# Altium schematic sheet Eth_Switch_RJ45.SchDoc
size A3
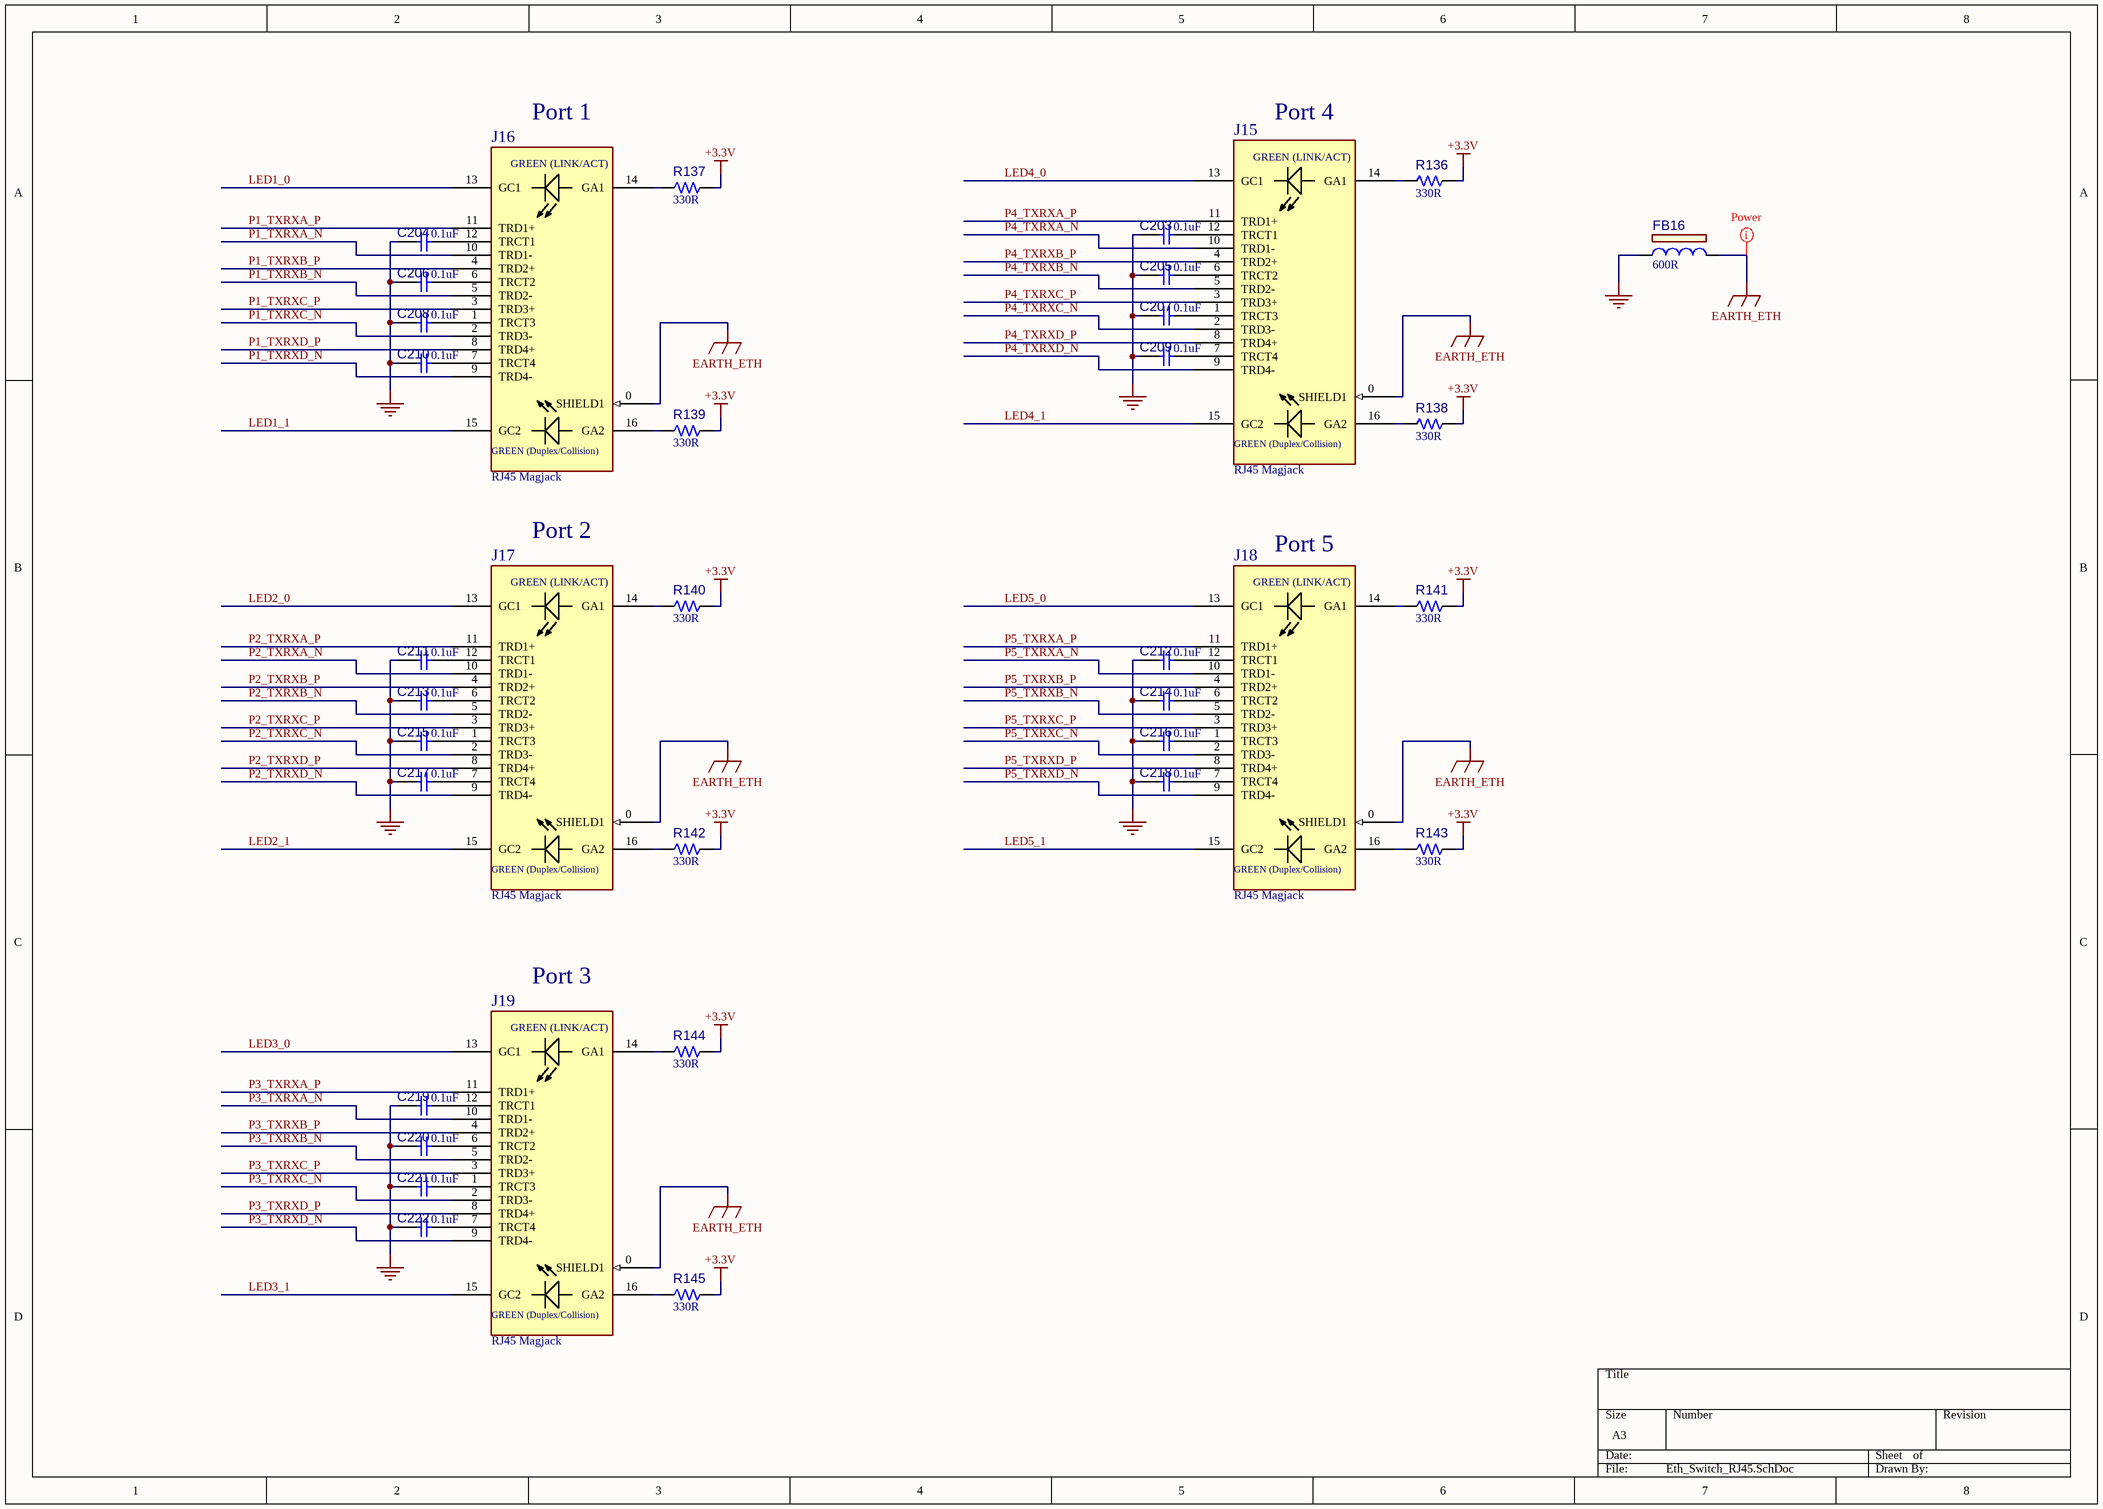
[diagram p0: Eth_Switch_RJ45.SchDoc]

## Parts
C203  value 0.1uF  [CAP_C_0402]  (hidden comment: Capacitor NP)
C204  value 0.1uF  [CAP_C_0402]  (hidden comment: Capacitor NP)
C205  value 0.1uF  [CAP_C_0402]  (hidden comment: Capacitor NP)
C206  value 0.1uF  [CAP_C_0402]  (hidden comment: Capacitor NP)
C207  value 0.1uF  [CAP_C_0402]  (hidden comment: Capacitor NP)
C208  value 0.1uF  [CAP_C_0402]  (hidden comment: Capacitor NP)
C209  value 0.1uF  [CAP_C_0402]  (hidden comment: Capacitor NP)
C210  value 0.1uF  [CAP_C_0402]  (hidden comment: Capacitor NP)
C211  value 0.1uF  [CAP_C_0402]  (hidden comment: Capacitor NP)
C212  value 0.1uF  [CAP_C_0402]  (hidden comment: Capacitor NP)
C213  value 0.1uF  [CAP_C_0402]  (hidden comment: Capacitor NP)
C214  value 0.1uF  [CAP_C_0402]  (hidden comment: Capacitor NP)
C215  value 0.1uF  [CAP_C_0402]  (hidden comment: Capacitor NP)
C216  value 0.1uF  [CAP_C_0402]  (hidden comment: Capacitor NP)
C217  value 0.1uF  [CAP_C_0402]  (hidden comment: Capacitor NP)
C218  value 0.1uF  [CAP_C_0402]  (hidden comment: Capacitor NP)
C219  value 0.1uF  [CAP_C_0402]  (hidden comment: Capacitor NP)
C220  value 0.1uF  [CAP_C_0402]  (hidden comment: Capacitor NP)
C221  value 0.1uF  [CAP_C_0402]  (hidden comment: Capacitor NP)
C222  value 0.1uF  [CAP_C_0402]  (hidden comment: Capacitor NP)
FB16  value 600R  [IND_C_0805]  (hidden comment: Ferrite Bead)
J15  RJ45 Magjack  [CON_MODULAR_RJ45_TH_RA_RJMG2012211A0FR]
J16  RJ45 Magjack  [CON_MODULAR_RJ45_TH_RA_RJMG2012211A0FR]
J17  RJ45 Magjack  [CON_MODULAR_RJ45_TH_RA_RJMG2012211A0FR]
J18  RJ45 Magjack  [CON_MODULAR_RJ45_TH_RA_RJMG2012211A0FR]
J19  RJ45 Magjack  [CON_MODULAR_RJ45_TH_RA_RJMG2012211A0FR]
R136  value 330R  [RES_C_0603]  (hidden comment: Resistor)
R137  value 330R  [RES_C_0603]  (hidden comment: Resistor)
R138  value 330R  [RES_C_0603]  (hidden comment: Resistor)
R139  value 330R  [RES_C_0603]  (hidden comment: Resistor)
R140  value 330R  [RES_C_0603]  (hidden comment: Resistor)
R141  value 330R  [RES_C_0603]  (hidden comment: Resistor)
R142  value 330R  [RES_C_0603]  (hidden comment: Resistor)
R143  value 330R  [RES_C_0603]  (hidden comment: Resistor)
R144  value 330R  [RES_C_0603]  (hidden comment: Resistor)
R145  value 330R  [RES_C_0603]  (hidden comment: Resistor)

## Nets
+3.3V: R136.2 R137.2 R138.2 R139.2 R140.2 R141.2 R142.2 R143.2 R144.2 R145.2
EARTH_ETH: FB16.2 J15.0(SHIELD1) J16.0(SHIELD1) J17.0(SHIELD1) J18.0(SHIELD1) J19.0(SHIELD1)
GND: C203.2 C204.2 C205.2 C206.2 C207.2 C208.2 C209.2 C210.2 C211.2 C212.2 C213.2 C214.2 C215.2 C216.2 C217.2 C218.2 C219.2 C220.2 C221.2 C222.2 FB16.1
LED1_0: J16.13(GC1)
LED1_1: J16.15(GC2)
LED2_0: J17.13(GC1)
LED2_1: J17.15(GC2)
LED3_0: J19.13(GC1)
LED3_1: J19.15(GC2)
LED4_0: J15.13(GC1)
LED4_1: J15.15(GC2)
LED5_0: J18.13(GC1)
LED5_1: J18.15(GC2)
P1_TXRXA_N: J16.10(TRD1-)
P1_TXRXA_P: J16.11(TRD1+)
P1_TXRXB_N: J16.5(TRD2-)
P1_TXRXB_P: J16.4(TRD2+)
P1_TXRXC_N: J16.2(TRD3-)
P1_TXRXC_P: J16.3(TRD3+)
P1_TXRXD_N: J16.9(TRD4-)
P1_TXRXD_P: J16.8(TRD4+)
P2_TXRXA_N: J17.10(TRD1-)
P2_TXRXA_P: J17.11(TRD1+)
P2_TXRXB_N: J17.5(TRD2-)
P2_TXRXB_P: J17.4(TRD2+)
P2_TXRXC_N: J17.2(TRD3-)
P2_TXRXC_P: J17.3(TRD3+)
P2_TXRXD_N: J17.9(TRD4-)
P2_TXRXD_P: J17.8(TRD4+)
P3_TXRXA_N: J19.10(TRD1-)
P3_TXRXA_P: J19.11(TRD1+)
P3_TXRXB_N: J19.5(TRD2-)
P3_TXRXB_P: J19.4(TRD2+)
P3_TXRXC_N: J19.2(TRD3-)
P3_TXRXC_P: J19.3(TRD3+)
P3_TXRXD_N: J19.9(TRD4-)
P3_TXRXD_P: J19.8(TRD4+)
P4_TXRXA_N: J15.10(TRD1-)
P4_TXRXA_P: J15.11(TRD1+)
P4_TXRXB_N: J15.5(TRD2-)
P4_TXRXB_P: J15.4(TRD2+)
P4_TXRXC_N: J15.2(TRD3-)
P4_TXRXC_P: J15.3(TRD3+)
P4_TXRXD_N: J15.9(TRD4-)
P4_TXRXD_P: J15.8(TRD4+)
P5_TXRXA_N: J18.10(TRD1-)
P5_TXRXA_P: J18.11(TRD1+)
P5_TXRXB_N: J18.5(TRD2-)
P5_TXRXB_P: J18.4(TRD2+)
P5_TXRXC_N: J18.2(TRD3-)
P5_TXRXC_P: J18.3(TRD3+)
P5_TXRXD_N: J18.9(TRD4-)
P5_TXRXD_P: J18.8(TRD4+)
NetC203_1: C203.1 J15.12(TRCT1)
NetC204_1: C204.1 J16.12(TRCT1)
NetC205_1: C205.1 J15.6(TRCT2)
NetC206_1: C206.1 J16.6(TRCT2)
NetC207_1: C207.1 J15.1(TRCT3)
NetC208_1: C208.1 J16.1(TRCT3)
NetC209_1: C209.1 J15.7(TRCT4)
NetC210_1: C210.1 J16.7(TRCT4)
NetC211_1: C211.1 J17.12(TRCT1)
NetC212_1: C212.1 J18.12(TRCT1)
NetC213_1: C213.1 J17.6(TRCT2)
NetC214_1: C214.1 J18.6(TRCT2)
NetC215_1: C215.1 J17.1(TRCT3)
NetC216_1: C216.1 J18.1(TRCT3)
NetC217_1: C217.1 J17.7(TRCT4)
NetC218_1: C218.1 J18.7(TRCT4)
NetC219_1: C219.1 J19.12(TRCT1)
NetC220_1: C220.1 J19.6(TRCT2)
NetC221_1: C221.1 J19.1(TRCT3)
NetC222_1: C222.1 J19.7(TRCT4)
NetJ15_14: J15.14(GA1) R136.1
NetJ15_16: J15.16(GA2) R138.1
NetJ16_14: J16.14(GA1) R137.1
NetJ16_16: J16.16(GA2) R139.1
NetJ17_14: J17.14(GA1) R140.1
NetJ17_16: J17.16(GA2) R142.1
NetJ18_14: J18.14(GA1) R141.1
NetJ18_16: J18.16(GA2) R143.1
NetJ19_14: J19.14(GA1) R144.1
NetJ19_16: J19.16(GA2) R145.1

## Layout directives
net class Power (VBUS): EARTH_ETH

## Notes on the sheet
- Port 1
- Port 4
- Port 2
- (near J18) Port 5
- Port 3
- (in symbol CON RJ-45 RJMG2012211A0FR) GREEN (LINK/ACT); GREEN (Duplex/Collision)

## Library data of the parts
C203-C222 = CAP1463: Capacitor; Manufacturer 1: TDK Corporation; Manufacturer Part Number 1: C1005X7R1H104K050BB; Voltage: 50V; Description_: CAP CER 0.1uF 50V 10% X7R SMD 0402; Dev Tools Status: Design; Tolerance: 10%; Temperature Coeffcient: X7R; Type: Ceramic; Owner: Jamus Griego; Populated: YES; MCHP-ID: CAP1463; Package: 0402; Revision: A; Status: MCL Design; ComponentLink1URL: https://chn-vm-apps.microchip.com/mchprepo/parts/Datasheets/TDKMLCCCapRange.pdf; ComponentLink1Description: Datasheets; Operating Temperature: -55C to +125C; Category: Capacitor; Supplier 1: Digi-Key; Supplier Part Number 1: 445-5932-1-ND; Quantity Override: 1
FB16 = IND1162: Manufacturer 1: TDK Corporation; Manufacturer Part Number 1: MPZ2012S601AT000; Description_: FERRITE 2A 600R SMD 0805; Dev Tools Status: Production; Owner: Randolph Sobrepena; DCR: 100M; Test Frequency: 100MHz; Populated: YES; MCHP-ID: IND1162; Revision: 1; Symbol: Ferrite Bead; Status: MCL Design; ComponentLink1URL: https://chn-vm-apps.microchip.com/mchprepo/parts/Datasheets/beads_commercial_power_mpz_en; ComponentLink1Description: Datasheet; Package: 0805; Type: Ferrite Bead; Category: Inductor; Supplier 1: Digi-Key; Supplier Part Number 1: 445-2206-1-ND; Quantity Override: 1
J15-J19 = CON RJ-45 RJMG2012211A0FR: Manufacturer 1: Amphenol Commercial Products; Populated: Yes; Description_: CON MODULAR RJ45 MAGJACK TH R/A; Manufacturer Part Number 1: RJMG2012211A0FR; RoHS: RoHS Compliant; ComponentLink1URL: https://www.amphenolcanada.com/ProductSearch/Drawings/AC/RJMG2012211A0FR.PDF; ComponentLink1Description: Datasheet; Supplier 1: Digikey; Supplier Part Number 1: RJMG2012211A0FR-ND; Value: RJ45 Magjack
R136-R145 = RSMT0166: Manufacturer 1: Panasonic; Manufacturer Part Number 1: ERJ-3GEYJ331V; Tolerance: 5%; Description_: RES TKF 330R 5% 1/10W SMD 0603; Dev Tools Status: Production; Voltage: 75V; Temperature Coeffcient: 200ppm/C; Power: 1/10W; Populated: Yes; MCHP-ID: RSMT0166; Package: 0603; Revision: 1; Status: MCL Design; ComponentLink1URL: https://chn-vm-apps.microchip.com/mchprepo/parts/Datasheets/AOA0000CE1.pdf; ComponentLink1Description: Datasheet; Operating Temperature: -55C to +155C; Category: Resistor; Type: RES SMD; Composition: TKF; Manufacturer 2: KOA Speer; Manufacturer Part Number 2: RK73B1JTTD331J; Manufacturer 3: Stackpole Electronics Inc; Manufacturer Part Number 3: RMCF 1/16 330 5% R; Supplier 1: Digi-Key; Supplier Part Number 1: P330GTR-ND; Supplier 2: KOA Speer; Supplier Part Number 2: RK73B1JTTD331J; Supplier 3: Stackpole Electronics Inc; Supplier Part Number 3: RMCF 1/16 330 5% R; Quantity Override: 1